# EAGLE design Micro DAQ Board5 (EAGLE 5.06)
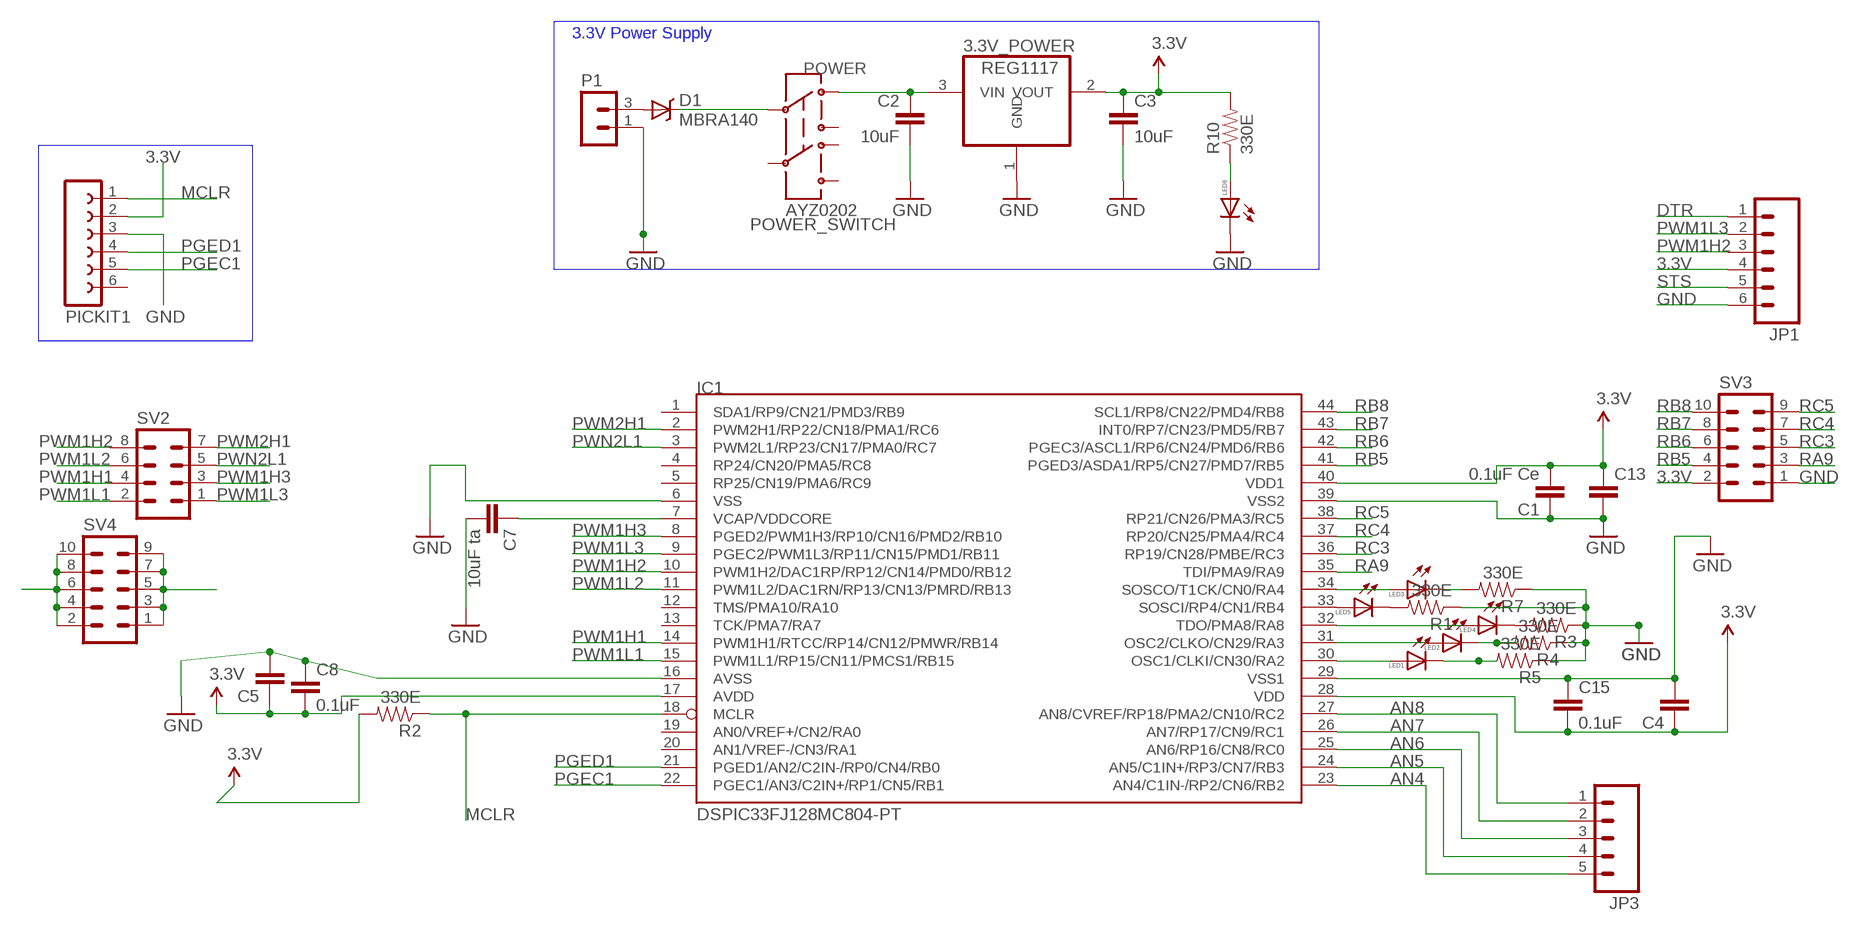
[diagram p0: schematic, sheet 1]

## Parts
3.3V_POWER  REG1117  [SOT223]
C1  0.1uF Ce  C-EUC0805  [C0805]
C2  10uF  C-EUC0805  [C0805]
C3  10uF  C-EUC0805  [C0805]
C4  C-EUC0805  [C0805]
C5  C-EUC0805  [C0805]
C7  10uF ta  C-EUC0805  [C0805]
C8  0.1uF  C-EUC0805  [C0805]
C13  C-EUC0805  [C0805]
C15  0.1uF  CAP0805  [0805]
D1  MBRA140  DIODE-SCHOTTKY_  [SMA-DIODE]
IC1  DSPIC33FJ128MC804-PT  [TQFP44]
JP1  M06SIP  [1X06]
JP3  M05PTH_LONGPADS  [1X05_LONGPADS]
LED1  LEDCHIPLED_0805  [CHIPLED_0805]
LED2  LEDCHIPLED_0805  [CHIPLED_0805]
LED3  LEDCHIPLED_0805  [CHIPLED_0805]
LED4  LEDCHIPLED_0805  [CHIPLED_0805]
LED5  LEDCHIPLED_0805  [CHIPLED_0805]
LED6  LEDCHIPLED_0805  [CHIPLED_0805]
P1  MA02-1  [MA02-1]
PICKIT1  FE06-1  [FE06]
POWER_SWITCH  AYZ0202  [AYZ0202]
R1  330E  RESISTOR0805-RES  [0805]
R2  330E  RESISTOR0805-RES  [0805]
R3  330E  RESISTOR0805-RES  [0805]
R4  330E  RESISTOR0805-RES  [0805]
R5  330E  RESISTOR0805-RES  [0805]
R7  330E  RESISTOR0805-RES  [0805]
R10  330E  RESISTOR0805-RES  [0805]
SV2  MA04-2  [MA04-2]
SV3  MA05-2  [MA05-2]
SV4  MA05-2  [MA05-2]

## Nets
3.3V: 3.3V_POWER.2(VOUT) C1.2 C3.1 C4.1 C5.1 C8.2 C13.1 C15.2 IC1.17(AVDD) IC1.28(VDD) IC1.40(VDD1) JP1.4 PICKIT1.2 R2.2 R10.2 SV3.2 SV4.2 SV4.4 SV4.6 SV4.8 SV4.10
AN4: IC1.23(AN4/C1IN-/RP2/CN6/RB2) JP3.5
AN5: IC1.24(AN5/C1IN+/RP3/CN7/RB3) JP3.4
AN6: IC1.25(AN6/RP16/CN8/RC0) JP3.3
AN7: IC1.26(AN7/RP17/CN9/RC1) JP3.2
AN8: IC1.27(AN8/CVREF/RP18/PMA2/CN10/RC2) JP3.1
DTR: JP1.1
GND: 3.3V_POWER.1(GND) C1.1 C2.2 C3.2 C4.2 C5.2 C7.2 C8.1 C13.2 C15.1 IC1.6(VSS) IC1.16(AVSS) IC1.29(VSS1) IC1.39(VSS2) JP1.6 LED6.C P1.1 PICKIT1.3 R1.1 R3.1 R4.1 R5.1 R7.1 SV3.1 SV4.1 SV4.3 SV4.5 SV4.7 SV4.9
MCLR: IC1.18(MCLR) PICKIT1.1 R2.1
N$1: LED5.C R1.2
N$2: LED1.C R5.2
N$3: IC1.33(SOSCI/RP4/CN1/RB4) LED5.A
N$4: LED2.C R4.2
N$5: IC1.34(SOSCO/T1CK/CN0/RA4) LED3.A
N$6: LED4.C R3.2
N$7: D1.A P1.3
N$9: LED3.C R7.2
N$10: LED6.A R10.1
N$15: D1.C POWER_SWITCH.2
PGEC1: IC1.22(PGEC1/AN3/C2IN+/RP1/CN5/RB1) PICKIT1.5
PGED1: IC1.21(PGED1/AN2/C2IN-/RP0/CN4/RB0) PICKIT1.4
POWER: 3.3V_POWER.3(VIN) C2.1 POWER_SWITCH.3
PWM1H1: IC1.14(PWM1H1/RTCC/RP14/CN12/PMWR/RB14) SV2.4
PWM1H2: IC1.10(PWM1H2/DAC1RP/RP12/CN14/PMD0/RB12) JP1.3 SV2.8
PWM1H3: IC1.8(PGED2/PWM1H3/RP10/CN16/PMD2/RB10) SV2.3
PWM1L1: IC1.15(PWM1L1/RP15/CN11/PMCS1/RB15) SV2.2
PWM1L2: IC1.11(PWM1L2/DAC1RN/RP13/CN13/PMRD/RB13) SV2.6
PWM1L3: IC1.9(PGEC2/PWM1L3/RP11/CN15/PMD1/RB11) JP1.2 SV2.1
PWM2H1: IC1.2(PWM2H1/RP22/CN18/PMA1/RC6) SV2.7
PWN2L1: IC1.3(PWM2L1/RP23/CN17/PMA0/RC7) SV2.5
RA2: IC1.30(OSC1/CLKI/CN30/RA2) LED1.A
RA3: IC1.31(OSC2/CLKO/CN29/RA3) LED2.A
RA8: IC1.32(TDO/PMA8/RA8) LED4.A
RA9: IC1.35(TDI/PMA9/RA9) SV3.3
RB5: IC1.41(PGED3/ASDA1/RP5/CN27/PMD7/RB5) SV3.4
RB6: IC1.42(PGEC3/ASCL1/RP6/CN24/PMD6/RB6) SV3.6
RB7: IC1.43(INT0/RP7/CN23/PMD5/RB7) SV3.8
RB8: IC1.44(SCL1/RP8/CN22/PMD4/RB8) SV3.10
RC3: IC1.36(RP19/CN28/PMBE/RC3) SV3.5
RC4: IC1.37(RP20/CN25/PMA4/RC4) SV3.7
RC5: IC1.38(RP21/CN26/PMA3/RC5) SV3.9
STS: JP1.5
VCAP/VDDCORE: C7.1 IC1.7(VCAP/VDDCORE)
Unconnected: IC1.1(SDA1/RP9/CN21/PMD3/RB9) IC1.4(RP24/CN20/PMA5/RC8) IC1.5(RP25/CN19/PMA6/RC9) IC1.12(TMS/PMA10/RA10) IC1.13(TCK/PMA7/RA7) IC1.19(AN0/VREF+/CN2/RA0) IC1.20(AN1/VREF-/CN3/RA1) PICKIT1.6 POWER_SWITCH.1 POWER_SWITCH.4 POWER_SWITCH.5 POWER_SWITCH.6

## Notes on the sheet
- 3.3V Power Supply

## Library data of the parts
3.3V_POWER = burr-brown:REG1117: 800mA and 1A Low Dropout (LDO) Positive Regulator 1.8V, 2.5V, 2.85V, 3.3V, 5V, and Adj
C1-C5 C7 C8 C13 = rcl:C-EU: CAPACITOR, European symbol
C15 = SparkFun:CAP: Capacitor Standard 0603 ceramic capacitor, and 0.1" leaded capacitor.
D1 = SparkFun:DIODE-SCHOTTKY
IC1 = microchip-dspic33fjxxmc:DSPIC33FJ128MC804: dsPIC33FJ32MC302/304, dsPIC33FJ64MCX02/X04, AND dsPIC33FJ128MCX02/X04 High-Performance, 16-bit Digital Signal Controllers Package:44 Pin TQFP Operating Range: * Up to 40 MIPS operation (at 3.0V -3.6V): - Industrial temperature range (-40°C to +85°C) - Extended temperature range (-40°C to +125°C) High-Performance DSC CPU: * Modified Harvard architecture * C compiler optimized instruction set * 16-bit wide data path * 24-bit wide instructions * Linear program memory addressing up to 4M instruction words * Linear data memory addressing up to 64 Kbytes * 83 base instructions: mostly 1 word/1 cycle * Two 40-bit accumulators with rounding and saturation options * Flexible and powerful addressing modes: - Indirect - Modulo - Bit-Reversed * Software stack * 16 x 16 fractional/integer multiply operations * 32/16 and 16/16 divide operations * Single-cycle multiply and accumulate: - Accumulator write back for DSP operations - Dual data fetch * Up to ±16-bit shifts for up to 40-bit data Direct Memory Access (DMA): * 8-channel hardware DMA * Up to 2 Kbytes dual ported DMA buffer area (DMA RAM) to store data transferred via DMA: - Allows data transfer between RAM and a peripheral while CPU is executing code (no cycle stealing) * Most peripherals support DMA Timers/Capture/Compare/PWM: * Timer/Counters, up to five 16-bit timers: - Can pair up to make two 32-bit timers - One timer runs as a Real-Time Clock with an external 32.768 kHz oscillator - Programmable prescaler * Input Capture (up to four channels): - Capture on up, down or both edges - 16-bit capture input functions - 4-deep FIFO on each capture * Output Compare (up to four channels): - Single or Dual 16-bit Compare mode - 16-bit Glitchless PWM mode * Hardware Real-Time Clock/Calendar (RTCC): - Provides clock, calendar, and alarm functions Interrupt Controller: * 5-cycle latency * Up to 53 available interrupt sources * Up to three external interrupts * Seven programmable priority levels * Five processor exceptions Digital I/O: * Peripheral pin Select functionality * Up to 35 programmable digital I/O pins * Wake-up/Interrupt-on-Change for up to 31 pins * Output pins can drive from 3.0V to 3.6V * Up to 5V output with open drain configuration * All digital input pins are 5V tolerant * 4 mA sink on all I/O pins On-Chip Flash and SRAM: * Flash program memory (up to 128 Kbytes) * Data SRAM (up to 16 Kbytes) * Boot, Secure, and General Security for program Flash System Management: * Flexible clock options: - External, crystal, resonator, internal RC - Fully integrated Phase-Locked Loop (PLL) - Extremely low jitter PLL * Power-up Timer * Oscillator Start-up Timer/Stabilizer * Watchdog Timer with its own RC oscillator * Fail-Safe Clock Monitor * Reset by multiple sources Power Management: * On-chip 2.5V voltage regulator * Switch between clock sources in real time * Idle, Sleep, and Doze modes with fast wake-up Analog-to-Digital Converters (ADCs): * 10-bit, 1.1 Msps or 12-bit, 500 Ksps conversion: - Two and four simultaneous samples (10-bit ADC) - Up to nine input channels with auto-scanning - Conversion start can be manual or synchronized with one of four trigger sources - Conversion possible in Sleep mode - ±2 LSb max integral nonlinearity - ±1 LSb max differential nonlinearity Audio Digital-to-Analog Converter (DAC): - 16-bit Dual Channel DAC module - 100 Ksps maximum sampling rate - Second-Order Digital Delta-Sigma Modulator Comparator Module: * Two analog comparators with programmable input/output configuration CMOS Flash Technology: * Low-power, high-speed Flash technology * Fully static design * 3.3V (±10%) operating voltage * Industrial and Extended temperature * Low power consumption Motor Control Peripherals: * 6-channel 16-bit Motor Control PWM: - Three duty cycle generators - Independent or Complementary mode - Programmable dead-time and output polarity - Edge-aligned or center-aligned - Manual output override control - One Fault input - Trigger for ADC conversions - PWM frequency for 16-bit resolution (@ 40 MIPS) = 1220 Hz for Edge-Aligned mode, 610 Hz for Center-Aligned mode - PWM frequency for 11-bit resolution (@ 40 MIPS) = 39.1 kHz for Edge-Aligned mode, 19.55 kHz for Center-Aligned mode * 2-channel 16-bit Motor Control PWM: - One duty cycle generator - Independent or Complementary mode - Programmable dead time and output polarity - Edge-aligned or center-aligned - Manual output override control - One Fault input - Trigger for ADC conversions - PWM frequency for 16-bit resolution (@ 40 MIPS) = 1220 Hz for Edge-Aligned mode, 610 Hz for Center-Aligned mode - PWM frequency for 11-bit resolution (@ 40 MIPS) = 39.1 kHz for Edge-Aligned mode, 19.55 kHz for Center-Aligned mode * 2-Quadrature Encoder Interface module: - Phase A, Phase B, and index pulse input - 16-bit up/down position counter - Count direction status - Position Measurement (x2 and x4) mode - Programmable digital noise filters on inputs - Alternate 16-bit Timer/Counter mode - Interrupt on position counter rollover/underflow
JP1 = SparkFun:M06: Header 6 Standard 6-pin 0.1" header. Use with straight break away headers (SKU : PRT-00116), right angle break away headers (PRT-00553), swiss pins (PRT-00743), machine pins (PRT-00117), and female headers (PRT-00115). Molex polarized connector foot print use with SKU : PRT-08094 with associated crimp pins and housings. NOTES ON THE VARIANTS LOCK and LOCK_LONGPADS... This footprint was designed to help hold the alignment of a through-hole component (i.e. 6-pin header) while soldering it into place. You may notice that each hole has been shifted either up or down by 0.005 of an inch from it's more standard position (which is a perfectly straight line). This slight alteration caused the pins (the squares in the middle) to touch the edges of the holes. Because they are alternating, it causes a "brace" to hold the component in place. 0.005 has proven to be the perfect amount of "off-center" position when using our standard breakaway headers. Although looks a little odd when you look at the bare footprint, once you have a header in there, the alteration is very hard to notice. Also, if you push a header all the way into place, it is covered up entirely on the bottom side. This idea of altering the position of holes to aid alignment will be further integrated into the Sparkfun Library for other footprints. It can help hold any component with 3 or more connection pins.
JP3 = SparkFun:M05: Header 5 Standard 5-pin 0.1" header. Use with straight break away headers (SKU : PRT-00116), right angle break away headers (PRT-00553), swiss pins (PRT-00743), machine pins (PRT-00117), and female headers (PRT-00115). Molex polarized connector foot print use with SKU : PRT-08230 with associated crimp pins and housings.
LED1-LED6 = led:LED: LED OSRAM: - CHIPLED LG R971, LG N971, LY N971, LG Q971, LY Q971, LO R971, LY R971 LH N974, LH R974 LS Q976, LO Q976, LY Q976 LO Q996 - Hyper CHIPLED LW Q18S LB Q993, LB Q99A, LB R99A - SideLED LS A670, LO A670, LY A670, LG A670, LP A670 LB A673, LV A673, LT A673, LW A673 LH A674 LY A675 LS A676, LA A676, LO A676, LY A676, LW A676 LS A679, LY A679, LG A679 - Hyper Micro SIDELED® LS Y876, LA Y876, LO Y876, LY Y876 LT Y87S - SmartLED LW L88C, LW L88S LB L89C, LB L89S, LG L890 LS L89K, LO L89K, LY L89K LS L896, LA L896, LO L896, LY L896 - TOPLED LS T670, LO T670, LY T670, LG T670, LP T670 LSG T670, LSP T670, LSY T670, LOP T670, LYG T670 LG T671, LOG T671, LSG T671 LB T673, LV T673, LT T673, LW T673 LH T674 LS T676, LA T676, LO T676, LY T676, LB T676, LH T676, LSB T676, LW T676 LB T67C, LV T67C, LT T67C, LS T67K, LO T67K, LY T67K, LW E67C LS E67B, LA E67B, LO E67B, LY E67B, LB E67C, LV E67C, LT E67C LW T67C LS T679, LY T679, LG T679 LS T770, LO T770, LY T770, LG T770, LP T770 LB T773, LV T773, LT T773, LW T773 LH T774 LS E675, LA E675, LY E675, LS T675 LS T776, LA T776, LO T776, LY T776, LB T776 LHGB T686 LT T68C, LB T68C - Hyper Mini TOPLED® LB M676 - Mini TOPLED Santana® LG M470 LS M47K, LO M47K, LY M47K Source: http://www.osram.convergy.de LUXEON: - LUMILED® LXK2-PW12-R00, LXK2-PW12-S00, LXK2-PW14-U00, LXK2-PW14-V00 LXK2-PM12-R00, LXK2-PM12-S00, LXK2-PM14-U00 LXK2-PE12-Q00, LXK2-PE12-R00, LXK2-PE12-S00, LXK2-PE14-T00, LXK2-PE14-U00 LXK2-PB12-K00, LXK2-PB12-L00, LXK2-PB12-M00, LXK2-PB14-N00, LXK2-PB14-P00, LXK2-PB14-Q00 LXK2-PR12-L00, LXK2-PR12-M00, LXK2-PR14-Q00, LXK2-PR14-R00 LXK2-PD12-Q00, LXK2-PD12-R00, LXK2-PD12-S00 LXK2-PH12-R00, LXK2-PH12-S00 LXK2-PL12-P00, LXK2-PL12-Q00, LXK2-PL12-R00 Source: www.luxeon.com KINGBRIGHT: KA-3528ASYC Source: www.kingbright.com
P1 = Pranjal:MA02-1
PICKIT1 = con-lsta:FE06-1: FEMALE HEADER
POWER_SWITCH = SparkFun:AYZ0202: SPDT Slide Switch Simple SMD single-pull double-throw slide switch. Good for less than 350mA power switch, switching UARTs between devices, etc. Spark Fun Electronics SKU : COM-00597
R1-R5 R7 R10 = SparkFun:RESISTOR: Resistor Basic schematic elements and footprints for 0603, 1206, and PTH resistors.
SV2 = con-lstb:MA04-2: PIN HEADER
SV3 SV4 = con-lstb:MA05-2: PIN HEADER

## Board
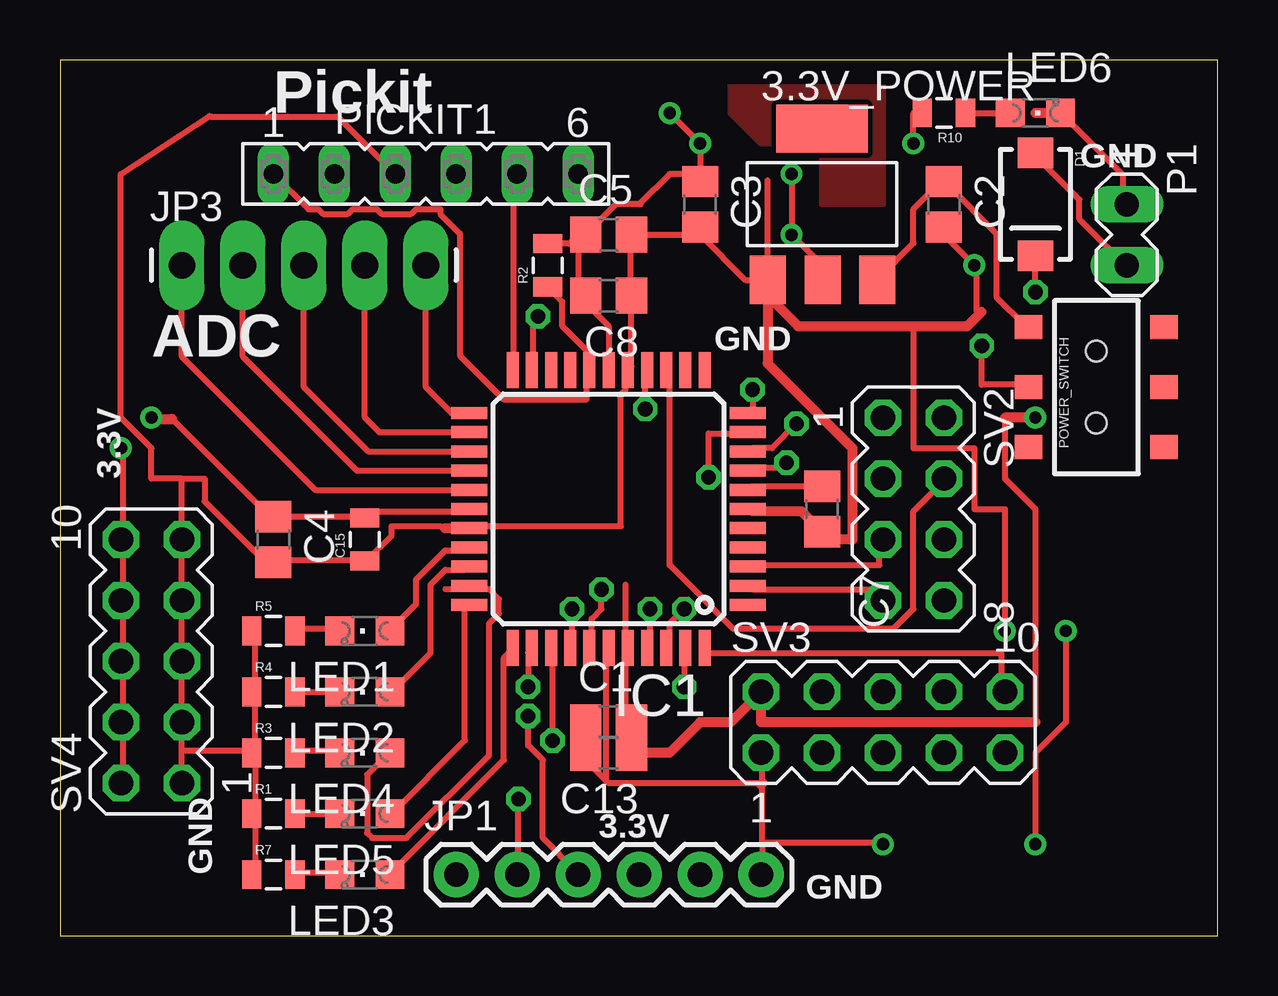
[diagram p1: board, top side]
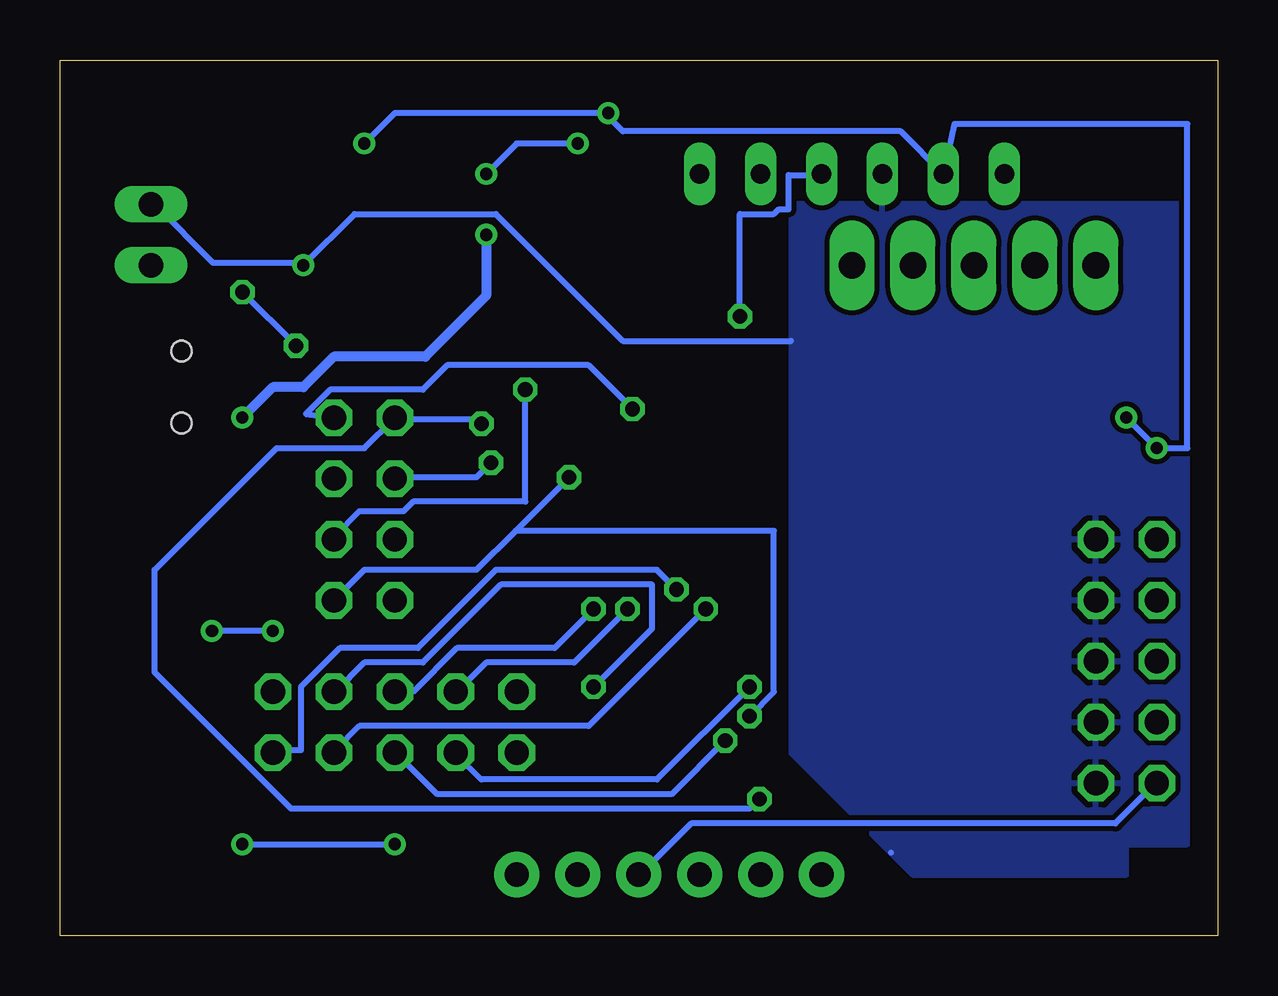
[diagram p2: board, bottom side, seen from below]

Size 48.24 x 36.5 mm. Coordinates in mm from the lower left corner, seen from the top.
Outline: 0,0 48.24,0 48.24,36.5 0,36.5 0,0
Copper layers (1*16): Top 0.035mm / dielectric 1.5mm / Bottom 0.035mm
Design rules "default": minimum track width 10mil, minimum drill 24mil, track to track 8mil, track to pad 8mil, pad to pad 8mil, via to via 8mil, smd to smd 8mil, copper to edge 40mil, drill to drill 8mil, minimum pad ring 10mil, minimum via ring 8mil, stop-mask expansion 4mil, vias tented up to drill 0mil, thermal gap 10mil

### Footprints (pad centres in the part's own frame; a part is rotated, then mirrored left to right if it is on the bottom)
SOT223 = smd 1.499 x 2.007: 1 -2.261,-3.15; 2 0.025,-3.15; 3 2.311,-3.15 | smd 3.81 x 2.007: 4 0,3.15
C0805 = smd 1.3 x 1.5: 1 -0.95,0; 2 0.95,0
0805 = smd 0.8 x 1.2: 1 -0.9,0; 2 0.9,0
SMA-DIODE = smd 1.27 x 1.47: A -2.15,0; C 2.15,0
TQFP44 = smd 1.5 x 0.5: 1 -5.8,4; 2 -5.8,3.2; 3 -5.8,2.4; 4 -5.8,1.6; 5 -5.8,0.8; 6 -5.8,0; 7 -5.8,-0.8; 8 -5.8,-1.6; 9 -5.8,-2.4; 10 -5.8,-3.2; 11 -5.8,-4; 23 5.8,-4; 24 5.8,-3.2; 25 5.8,-2.4; 26 5.8,-1.6; 27 5.8,-0.8; 28 5.8,0; 29 5.8,0.8; 30 5.8,1.6; 31 5.8,2.4; 32 5.8,3.2; 33 5.8,4 | smd 0.5 x 1.5: 12 -4,-5.8; 13 -3.2,-5.8; 14 -2.4,-5.8; 15 -1.6,-5.8; 16 -0.8,-5.8; 17 0,-5.8; 18 0.8,-5.8; 19 1.6,-5.8; 20 2.4,-5.8; 21 3.2,-5.8; 22 4,-5.8; 34 4,5.8; 35 3.2,5.8; 36 2.4,5.8; 37 1.6,5.8; 38 0.8,5.8; 39 0,5.8; 40 -0.8,5.8; 41 -1.6,5.8; 42 -2.4,5.8; 43 -3.2,5.8; 44 -4,5.8
1X06 = drill 1.016 pad 1.88 round: 1 0,0; 2 2.54,0; 3 5.08,0; 4 7.62,0; 5 10.16,0; 6 12.7,0
1X05_LONGPADS = drill 1.118 pad 1.88 long: 1 0,0; 2 2.54,0; 3 5.08,0; 4 7.62,0; 5 10.16,0
CHIPLED_0805 = smd 1.2 x 1.2: A 0,-1.05; C 0,1.05
MA02-1 = drill 1.016 long: 1 -1.27,0; 3 1.27,0
FE06 = drill 0.813 long: 1 -6.35,0; 2 -3.81,0; 3 -1.27,0; 4 1.27,0; 5 3.81,0; 6 6.35,0
AYZ0202 = smd 1 x 1.15: 1 -2.5,2.825; 2 0,2.825; 3 2.5,2.825; 4 -2.5,-2.825; 5 0,-2.825; 6 2.5,-2.825 | hole 0.85: 1.5,0; -1.5,0
MA04-2 = drill 1.016 octagon: 1 -3.81,-1.27; 2 -3.81,1.27; 3 -1.27,-1.27; 4 -1.27,1.27; 5 1.27,-1.27; 6 1.27,1.27; 7 3.81,-1.27; 8 3.81,1.27
MA05-2 = drill 1.016 octagon: 1 -5.08,-1.27; 2 -5.08,1.27; 3 -2.54,-1.27; 4 -2.54,1.27; 5 0,-1.27; 6 0,1.27; 7 2.54,-1.27; 8 2.54,1.27; 9 5.08,-1.27; 10 5.08,1.27

### Placement (x,y rotation side)
3.3V_POWER  31.75,30.48 0 top
C1  22.86,8.89 0 top
C2  36.83,30.48 270 top
C3  26.67,30.48 270 top
C4  8.89,16.51 270 top
C5  22.86,29.21 0 top
C7  31.75,17.78 270 top
C8  22.86,26.67 180 top
C13  22.86,7.62 180 top
C15  12.7,16.51 90 top
D1  40.64,30.48 270 top
IC1  22.86,17.78 180 top
JP1  16.51,2.54 0 top
JP3  5.08,27.94 0 top
LED1  12.7,12.7 90 top
LED2  12.7,10.16 90 top
LED3  12.7,2.54 90 top
LED4  12.7,7.62 90 top
LED5  12.7,5.08 90 top
LED6  40.64,34.29 270 top
P1  44.45,29.21 270 top
PICKIT1  15.24,31.75 0 top
POWER_SWITCH  43.18,22.86 90 top
R1  8.89,5.08 0 top
R2  20.32,27.94 90 top
R3  8.89,7.62 0 top
R4  8.89,10.16 0 top
R5  8.89,12.7 0 top
R7  8.89,2.54 0 top
R10  36.83,34.29 180 top
SV2  35.56,17.78 270 top
SV3  34.29,8.89 0 top
SV4  3.81,11.43 90 top

### Tracks (layer width: path | path; a pad name or v marks a point on that pad's centre or on a via)
3.3V  (via drill 0.51)
  Top 0.254: 21.59,28.91 21.74,29.06 C5.1 | 22.76,23.57 IC1.17 22.86,25.4 21.59,26.67 | 24.16,30.51 25.4,31.75 26.67,31.75 | 24.16,30.51 24.13,30.48 | 26.67,31.75 v26.67,33.02 v25.4,34.29 | 26.67,31.75 C3.1 | v30.48,31.75 v30.48,29.21 31.75,27.94 3.3V_POWER.2 | v35.56,33.02 35.56,34.29 R10.2 | C5.1 21.59,29.21 | 21.59,29.21 21.59,26.67 | 21.59,26.67 C8.2 | R2.2 21.22,28.84 21.59,29.21 | SV4.2 2.64,6.5 2.64,8.74 SV4.4 2.64,8.94 2.64,11.38 SV4.6 2.64,11.58 2.64,13.82 SV4.8 2.64,14.02 2.64,16.46 SV4.10 2.64,16.66 2.64,20.32 v2.54,20.32 | 23.57,14.63 23.57,11.99 IC1.40 23.57,11.79 23.57,7.93 23.77,7.72 | 40.64,8.89 40.64,17.78 39.37,19.05 39.37,21.59 | IC1.28 16.87,17.68 12.8,17.68 12.8,17.48 C15.2 12.6,17.48 8.94,17.48 C4.1 8.74,17.48 4.67,21.54 | v3.81,21.59 3.86,21.54 | C5.1 21.95,29.26 23.16,30.48 24.18,30.48 24.16,30.51 | 23.77,7.72 23.77,8.74 C1.2 | C13.1 23.77,7.72
  Top 0.406: C13.1 25.4,7.62 26.67,8.89 27.94,8.89 SV3.2 29.21,8.89 40.64,8.89 | v40.64,21.59 39.37,21.59 | 3.86,21.54 4.67,21.54
  Bottom 0.254: v30.48,31.75 29.21,33.02 v26.67,33.02 | v35.56,33.02 34.29,34.29 v25.4,34.29 25.4,34.14 24.79,33.53 13.21,33.53 PICKIT1.2 10.97,33.83 1.27,33.83 1.27,20.32 v2.54,20.32 v3.81,21.59 | JP1.4 23.98,2.64 21.95,4.67 4.27,4.67 2.64,6.3 SV4.2
  Bottom 0.406: v40.64,21.59 39.37,22.86 38.1,22.86 36.83,24.13 33.02,24.13 30.48,26.67 v30.48,29.21
AN4
  Top 0.254: IC1.23 16.32,21.78 15.24,22.86 JP3.5
AN5
  Top 0.254: IC1.24 13.31,20.98 12.7,21.59 JP3.4
AN6
  Top 0.254: IC1.25 12.84,20.18 10.16,22.86 JP3.3
AN7
  Top 0.254: IC1.26 12.37,19.38 7.62,24.13 JP3.2
AN8
  Top 0.254: IC1.27 10.63,18.58 5.08,24.13 JP3.1
GND  (via drill 0.51)
  Top 0.254: C5.2 23.77,29.06 | 31.7,16.87 C7.2 32.07,16.51 | 28.85,17.68 IC1.6 | 3.3V_POWER.1 29.49,26.67 | 3.3V_POWER.1 28.55,27.33 26.67,29.21 | C5.2 26.67,29.21 | C5.2 23.77,29.17 23.77,26.82 C8.1 23.81,23.73 IC1.16 23.57,23.57 23.57,22.76 23.37,22.55 23.37,17.07 17.07,17.07 IC1.29 | 3.3V_POWER.1 29.49,31.47 | 5.08,19.05 6.03,19.05 6.03,18.1 8.89,15.24 | C13.2 21.91,7.3 22.73,6.48 | 22.73,6.48 22.86,6.35 29.26,6.35 | 22.86,11.43 IC1.39 22.76,11.38 22.76,6.5 22.73,6.48 | 5.08,19.05 3.81,19.05 3.81,20.32 2.54,21.59 2.54,31.75 6.22,34.16 6.3,34.14 11.58,34.14 PICKIT1.3 | SV4.1 5.08,7.72 | 5.08,7.72 SV4.3 SV4.5 SV4.7 SV4.9 5.08,19.05 | C3.2 26.62,29.46 26.62,29.26 26.67,29.21 | SV3.1 29.26,7.52 29.26,6.35 | LED6.C 41.86,34.14 44.3,31.7 44.3,30.48 P1.1 | 3.3V_POWER.1 29.67,27.23 | JP1.6 29.26,2.64 29.26,3.86 | 29.26,3.86 29.26,6.35 | C4.2 8.94,15.65 12.6,15.65 C15.1 12.8,15.65 13.82,16.66 13.82,17.07 15.85,17.07 16.04,16.98 | 8.13,5.08 8.13,2.64 R7.1 | 8.13,10.16 8.13,7.72 R3.1 | 8.13,10.16 8.13,12.6 R5.1 | 8.13,10.16 R4.1 | 8.13,5.08 8.13,7.52 R3.1 | 8.13,5.08 R1.1 | 5.08,7.72 7.92,7.72 R3.1 | 35.56,25.4 35.56,20.32 38.1,20.32 38.1,17.78 39.37,17.78 v39.37,12.7 | v41.91,12.7 41.91,8.89 40.64,7.62 v40.64,3.81 | 29.26,3.86 34.14,3.86 v34.29,3.81 | 38.3,25.91 38.2,26.01 38.2,27.84 v38.1,27.94 36.98,29.06 36.98,29.46 C2.2
  Top 0.406: 32.07,16.51 33.02,16.51 33.02,20.32 29.49,23.85 29.49,26.67 30.76,25.4 35.56,25.4 37.8,25.4 38.3,25.91 38.41,26.01 | 28.85,17.68 30.9,17.68 C7.2 | 16.04,16.98 IC1.29 | C13.2 C1.1 | 40.64,34.29 LED6.C 41.91,34.29 | 29.26,6.35 29.21,6.3
  Bottom 0.254: P1.1 44.3,30.48 41.86,28.04 38.2,28.04 v38.1,27.94 35.97,30.07 30.07,30.07 24.79,24.79 17.78,24.79 | JP1.6 29.06,2.44 | 13.61,3.46 13.61,3.45 | v39.37,12.7 v41.91,12.7 | v40.64,3.81 v34.29,3.81
  pour Bottom: 12.7,2.54 3.81,2.54 3.81,3.81 1.27,3.81 1.27,30.48 17.78,30.48 17.78,7.62
MCLR
  Top 0.254: R2.1 20.32,27.03 20.93,26.42 20.93,25.4 21.95,24.38 21.95,23.77 IC1.18 21.95,23.57 21.95,22.35 18.49,22.35 16.66,24.18 16.66,29.26 15.85,30.07 15.85,30.28 14.83,30.28 14.63,30.07 13.41,30.07 13.21,30.28 12.19,30.28 11.99,30.07 10.97,30.07 10.77,30.28 10.36,30.28 PICKIT1.1
N$1
  Top 0.254: R1.2 LED5.C
N$2
  Top 0.254: R5.2 9.96,12.8 11.58,12.8 LED1.C
N$3
  Top 0.254: LED5.A 13.82,5.08 16.87,8.13 16.87,13.61 IC1.33
N$4
  Top 0.254: R4.2 LED2.C
N$5
  Top 0.254: LED3.A 13.82,2.64 18.49,7.31 18.49,11.58 18.69,11.79 IC1.34
N$6
  Top 0.254: R3.2 9.96,7.72 11.58,7.72 LED4.C
N$7
  Top 0.254: D1.A 40.64,32.51 42.47,30.68 42.47,29.87 44.3,28.04 P1.3
N$9
  Top 0.254: R7.2 9.96,2.64 11.58,2.64 LED3.C
N$10
  Top 0.254: 37.8,34.34 R10.1 LED6.A 39.42,34.34
N$13
  pour Top: 30.48,33.02 29.21,33.02 27.94,34.29 27.94,35.56 34.29,35.56 34.29,33.02 34.29,30.48 31.75,30.48 31.75,33.02
N$15  (via drill 0.61)
  Top 0.254: v38.41,24.59 38.41,22.96 40.23,22.96 POWER_SWITCH.2 | v40.64,26.82 D1.C
  Bottom 0.254: v38.41,24.59 v40.64,26.82
PGEC1
  Top 0.254: IC1.22 18.9,23.77 18.9,31.7 PICKIT1.5
PGED1  (via drill 0.61)
  Top 0.254: v19.91,25.81 19.71,25.6 19.71,23.77 IC1.21
  Bottom 0.254: v19.91,25.81 19.91,30.07 18.49,30.07 18.29,30.28 17.88,30.28 17.88,31.7 16.66,31.7 PICKIT1.4
POWER
  Top 0.254: POWER_SWITCH.3 40.23,25.4 39.01,26.62 39.01,29.26 36.98,31.29 C2.1 36.78,31.5 35.56,30.28 35.56,28.85 34.14,27.43 3.3V_POWER.3
PWM1H1
  Top 0.254: IC1.14 25.4,23.57 25.4,15.44 28.04,12.8 34.75,12.8 35.56,13.61 35.56,17.68 36.78,18.9 SV2.4
PWM1H2  (via drill 0.61)
  Top 0.254: v27.03,19.1 27.03,20.93 28.65,20.93 IC1.10 | v19.51,9.14 19.51,7.93 20.12,7.31 20.12,4.06 21.54,2.64 JP1.3
  Bottom 0.254: 29.26,16.87 v27.03,19.1 | 29.26,16.87 30.89,15.24 35.56,15.24 SV2.8 | v19.51,9.14 18.49,10.16 18.49,16.87 29.26,16.87
PWM1H3  (via drill 0.61)
  Top 0.254: v30.28,19.71 30.28,19.51 28.85,19.51 IC1.8
  Bottom 0.254: v30.28,19.71 30.89,19.1 34.14,19.1 SV2.3
PWM1L1  (via drill 0.61)
  Top 0.254: v24.38,21.95 24.38,23.57 IC1.15
  Bottom 0.254: v24.38,21.95 26.21,23.77 32.11,23.77 33.12,22.76 36.98,22.76 38,21.74 SV2.2
PWM1L2  (via drill 0.61)
  Top 0.254: v28.85,22.76 28.85,21.95 IC1.11
  Bottom 0.254: v28.85,22.76 28.85,18.09 33.53,18.09 33.93,17.68 35.76,17.68 36.78,16.66 SV2.6
PWM1L3  (via drill 0.61)
  Top 0.254: v30.68,21.34 29.67,20.32 28.85,20.32 IC1.9 | JP1.2 19.1,2.64 | 19.1,2.59 v19.1,5.69
  Top 0.406: JP1.2 19.1,2.59
  Bottom 0.254: v30.68,21.34 30.89,21.54 34.34,21.54 | v19.1,5.69 19.51,5.28 38.61,5.28 44.3,10.97 44.3,15.24 39.22,20.32 35.56,20.32 34.34,21.54 | 34.34,21.54 SV2.1
PWM2H1
  Top 0.254: IC1.2 28.85,14.43 34.14,14.43 34.14,14.02 SV2.7
PWN2L1
  Top 0.254: IC1.3 28.85,15.44 34.14,15.44 34.14,16.46 SV2.5
RA2
  Top 0.254: LED1.A 13.82,12.8 14.83,13.82 14.83,14.83 16.05,16.05 16.87,16.05 IC1.30
RA3
  Top 0.254: 16.87,15.44 IC1.31 16.87,15.24 16.05,15.24 15.44,14.63 15.44,11.79 13.82,10.16 LED2.A
RA8
  Top 0.254: 16.05,14.43 16.87,14.43 IC1.32 17.07,14.43 17.88,14.43 18.29,14.02 18.29,13.41 17.88,13 17.88,7.52 14.43,4.06 13.01,4.06 12.8,4.27 12.8,6.71 13.61,7.52 LED4.A
RA9  (via drill 0.61)
  Top 0.254: v19.51,10.36 19.51,11.79 IC1.35
  Bottom 0.254: v19.51,10.36 23.37,6.5 30.68,6.5 31.7,7.52 SV3.3
RB5  (via drill 0.61)
  Top 0.254: v24.59,13.61 24.59,11.99 IC1.41
  Bottom 0.254: v24.59,13.61 26.82,11.38 30.48,11.38 31.7,10.16 SV3.4
RB6  (via drill 0.61)
  Top 0.254: v26.01,13.61 25.4,13 25.4,11.99 IC1.42
  Bottom 0.254: v26.01,13.61 27.64,11.99 31.7,11.99 33.53,10.16 SV3.6
RB7  (via drill 0.61)
  Top 0.254: v26.01,10.36 26.01,11.79 IC1.43
  Bottom 0.254: v26.01,10.36 23.57,12.8 23.57,14.63 29.87,14.63 33.12,11.38 35.56,11.38 36.78,10.16 SV3.8
RB8
  Top 0.254: IC1.44 27.03,11.79 39.22,11.79 39.22,10.16 SV3.10
RC3  (via drill 0.61)
  Top 0.254: v20.52,8.13 20.52,11.79 IC1.36
  Bottom 0.254: v20.52,8.13 22.76,5.89 32.51,5.89 34.14,7.52 SV3.5
RC4  (via drill 0.61)
  Top 0.254: v21.34,13.61 21.34,11.99 IC1.37
  Bottom 0.254: v21.34,13.61 26.21,8.74 35.76,8.74 36.78,7.72 SV3.7
RC5  (via drill 0.61)
  Top 0.254: v22.55,14.43 22.55,13.61 22.15,13.21 22.15,11.99 IC1.38
  Bottom 0.254: SV3.9 39.22,7.72 38.2,7.72 38.2,10.36 36.58,11.99 33.33,11.99 30.07,15.24 23.37,15.24 v22.55,14.43
VCAP/VDDCORE
  Top 0.254: C7.1 28.81,18.73 IC1.7

### Text on the board
tPlace: Pickit | GND | GND | ADC | 3.3V | 3.3V | GND | GND